# Altium schematic sheet Connect.SchDoc
size A4
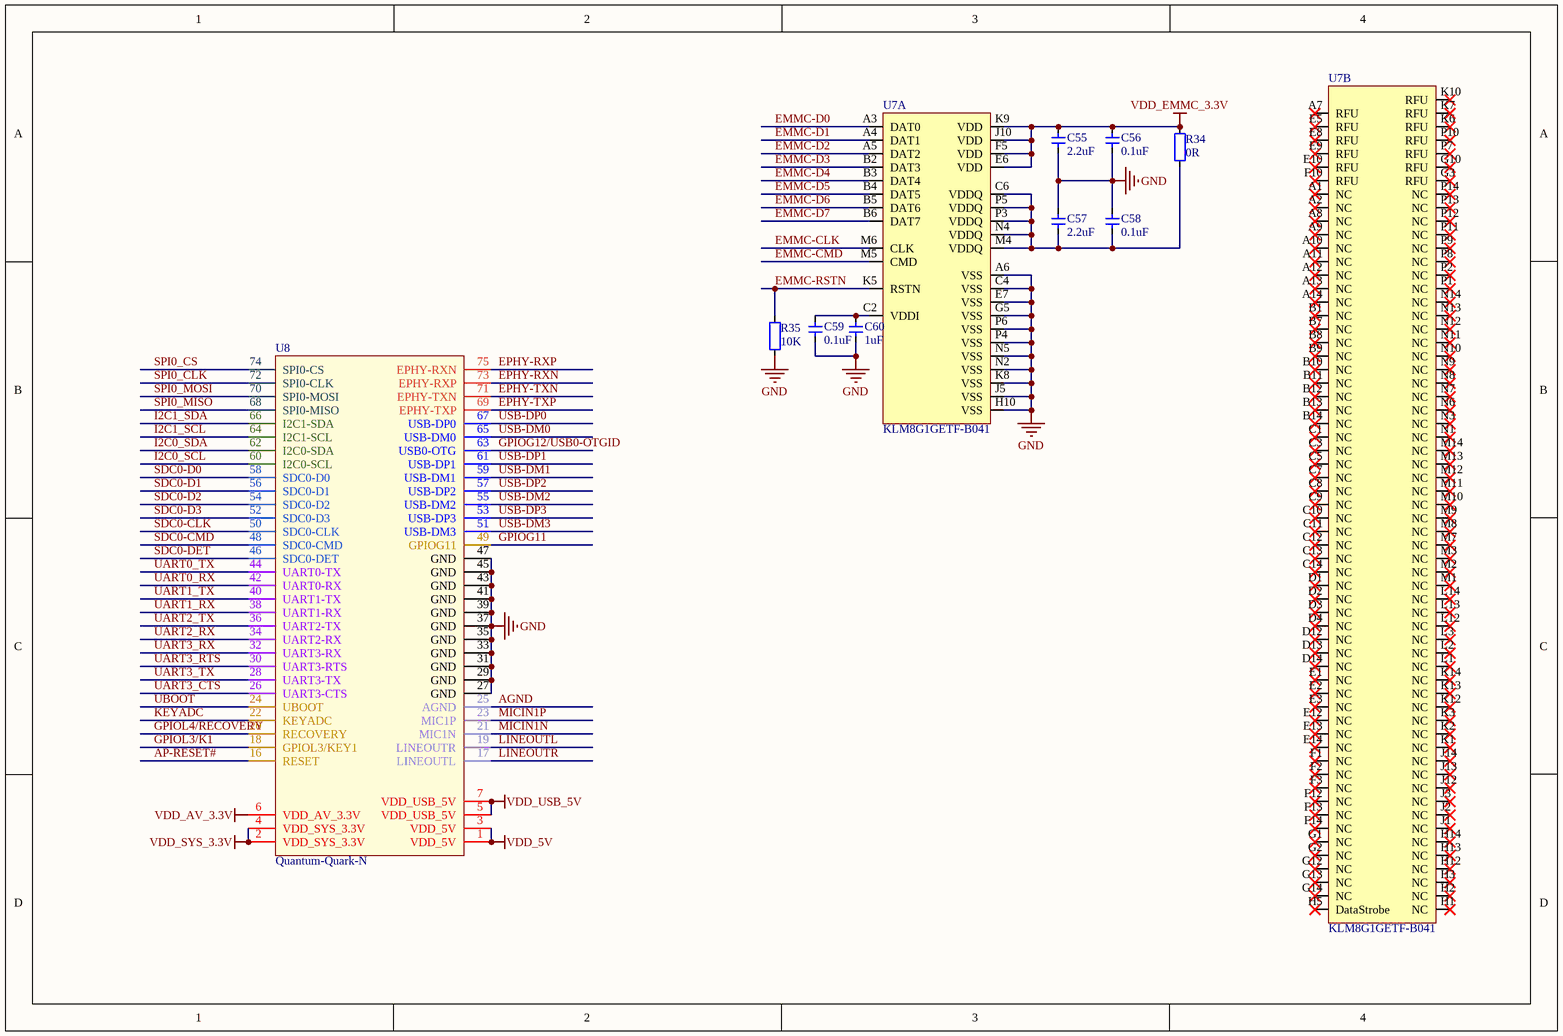
[diagram p0: Connect.SchDoc]

## Parts
C55  2.2uF  [CAP_0402]
C56  0.1uF  [CAP_0402]
C57  2.2uF  [CAP_0402]
C58  0.1uF  [CAP_0402]
C59  0.1uF  [CAP_0402]
C60  1uF  [CAP_0402]
R34  0R  [RES_0402]
R35  10K  [RES_0402]
U7  KLM8G1GETF-B041  [FBGA153]  (parts A,B of 2)
U8  Quantum-Quark-N  [M.2]

## Nets
GND: C55.1 C56.1 C57.2 C58.2 C59.1 C60.1 R35.1 U7.A6(VSS) U7.C4(VSS) U7.E7(VSS) U7.G5(VSS) U7.H10(VSS) U7.J5(VSS) U7.K8(VSS) U7.N2(VSS) U7.N5(VSS) U7.P4(VSS) U7.P6(VSS) U8.27(GND) U8.29(GND) U8.31(GND) U8.33(GND) U8.35(GND) U8.37(GND) U8.39(GND) U8.41(GND) U8.43(GND) U8.45(GND) U8.47(GND)
VDD_5V: U8.1(VDD_5V) U8.3(VDD_5V)
VDD_AV_3.3V: U8.6(VDD_AV_3.3V)
VDD_EMMC_3.3V: C55.2 C56.2 R34.1 U7.E6(VDD) U7.F5(VDD) U7.J10(VDD) U7.K9(VDD)
VDD_SYS_3.3V: U8.2(VDD_SYS_3.3V) U8.4(VDD_SYS_3.3V)
VDD_USB_5V: U8.5(VDD_USB_5V) U8.7(VDD_USB_5V)
AGND: U8.25(AGND)
AP-RESET#: U8.16(RESET)
EMMC-CLK: U7.M6(CLK)
EMMC-CMD: U7.M5(CMD)
EMMC-D0: U7.A3(DAT0)
EMMC-D1: U7.A4(DAT1)
EMMC-D2: U7.A5(DAT2)
EMMC-D3: U7.B2(DAT3)
EMMC-D4: U7.B3(DAT4)
EMMC-D5: U7.B4(DAT5)
EMMC-D6: U7.B5(DAT6)
EMMC-D7: U7.B6(DAT7)
EMMC-RSTN: R35.2 U7.K5(RSTN)
EPHY-RXN: U8.73(EPHY-RXP)
EPHY-RXP: U8.75(EPHY-RXN)
EPHY-TXN: U8.71(EPHY-TXN)
EPHY-TXP: U8.69(EPHY-TXP)
GPIOG11: U8.49(GPIOG11)
GPIOG12/USB0-OTGID: U8.63(USB0-OTG)
GPIOL3/K1: U8.18(GPIOL3/KEY1)
GPIOL4/RECOVERY: U8.20(RECOVERY)
I2C0_SCL: U8.60(I2C0-SCL)
I2C0_SDA: U8.62(I2C0-SDA)
I2C1_SCL: U8.64(I2C1-SCL)
I2C1_SDA: U8.66(I2C1-SDA)
KEYADC: U8.22(KEYADC)
LINEOUTL: U8.19(LINEOUTR)
LINEOUTR: U8.17(LINEOUTL)
MICIN1N: U8.21(MIC1N)
MICIN1P: U8.23(MIC1P)
SDC0-CLK: U8.50(SDC0-CLK)
SDC0-CMD: U8.48(SDC0-CMD)
SDC0-D0: U8.58(SDC0-D0)
SDC0-D1: U8.56(SDC0-D1)
SDC0-D2: U8.54(SDC0-D2)
SDC0-D3: U8.52(SDC0-D3)
SDC0-DET: U8.46(SDC0-DET)
SPI0_CLK: U8.72(SPI0-CLK)
SPI0_CS: U8.74(SPI0-CS)
SPI0_MISO: U8.68(SPI0-MISO)
SPI0_MOSI: U8.70(SPI0-MOSI)
UART0_RX: U8.42(UART0-RX)
UART0_TX: U8.44(UART0-TX)
UART1_RX: U8.38(UART1-RX)
UART1_TX: U8.40(UART1-TX)
UART2_RX: U8.34(UART2-RX)
UART2_TX: U8.36(UART2-TX)
UART3_CTS: U8.26(UART3-CTS)
UART3_RTS: U8.30(UART3-RTS)
UART3_RX: U8.32(UART3-RX)
UART3_TX: U8.28(UART3-TX)
UBOOT: U8.24(UBOOT)
USB-DM0: U8.65(USB-DM0)
USB-DM1: U8.59(USB-DM1)
USB-DM2: U8.55(USB-DM2)
USB-DM3: U8.51(USB-DM3)
USB-DP0: U8.67(USB-DP0)
USB-DP1: U8.61(USB-DP1)
USB-DP2: U8.57(USB-DP2)
USB-DP3: U8.53(USB-DP3)
NetC57_1: C57.1 C58.1 R34.2 U7.C6(VDDQ) U7.M4(VDDQ) U7.N4(VDDQ) U7.P3(VDDQ) U7.P5(VDDQ)
NetC59_2: C59.2 C60.2 U7.C2(VDDI)

Not connected (* = marked no-connect by the designer): U7 A1(NC)* A2(NC)* A7(RFU)* A8(NC)* A9(NC)* A10(NC)* A11(NC)* A12(NC)* A13(NC)* A14(NC)* B1(NC)* B7(NC)* B8(NC)* B9(NC)* B10(NC)* B11(NC)* B12(NC)* B13(NC)* B14(NC)* C1(NC)* C3(NC)* C5(NC)* C7(NC)* C8(NC)* C9(NC)* C10(NC)* C11(NC)* C12(NC)* C13(NC)* C14(NC)* D1(NC)* D2(NC)* D3(NC)* D4(NC)* D12(NC)* D13(NC)* D14(NC)* E1(NC)* E2(NC)* E3(NC)* E5(RFU)* E8(RFU)* E9(RFU)* E10(RFU)* E12(NC)* E13(NC)* E14(NC)* F1(NC)* F2(NC)* F3(NC)* F10(RFU)* F12(NC)* F13(NC)* F14(NC)* G1(NC)* G2(NC)* G3(RFU)* G10(RFU)* G12(NC)* G13(NC)* G14(NC)* H1(NC)* H2(NC)* H3(NC)* H5(DataStrobe)* H12(NC)* H13(NC)* H14(NC)* J1(NC)* J2(NC)* J3(NC)* J12(NC)* J13(NC)* J14(NC)* K1(NC)* K2(NC)* K3(NC)* K6(RFU)* K7(RFU)* K10(RFU)* K12(NC)* K13(NC)* K14(NC)* L1(NC)* L2(NC)* L3(NC)* L12(NC)* L13(NC)* L14(NC)* M1(NC)* M2(NC)* M3(NC)* M7(NC)* M8(NC)* M9(NC)* M10(NC)* M11(NC)* M12(NC)* M13(NC)* M14(NC)* N1(NC)* N3(NC)* N6(NC)* N7(NC)* N8(NC)* N9(NC)* N10(NC)* N11(NC)* N12(NC)* N13(NC)* N14(NC)* P1(NC)* P2(NC)* P7(RFU)* P8(NC)* P9(NC)* P10(RFU)* P11(NC)* P12(NC)* P13(NC)* P14(NC)*

## Library data of the parts
C55-C60 = 电容-0402: Capacitor; Value: 0.1u
R34 R35 = 电阻-0402: Resistor; Value: 22R
U7 = EMMC: 8GB三星EMMC芯片